# EAGLE design open-usb-can-2021 (EAGLE 9.6.2)
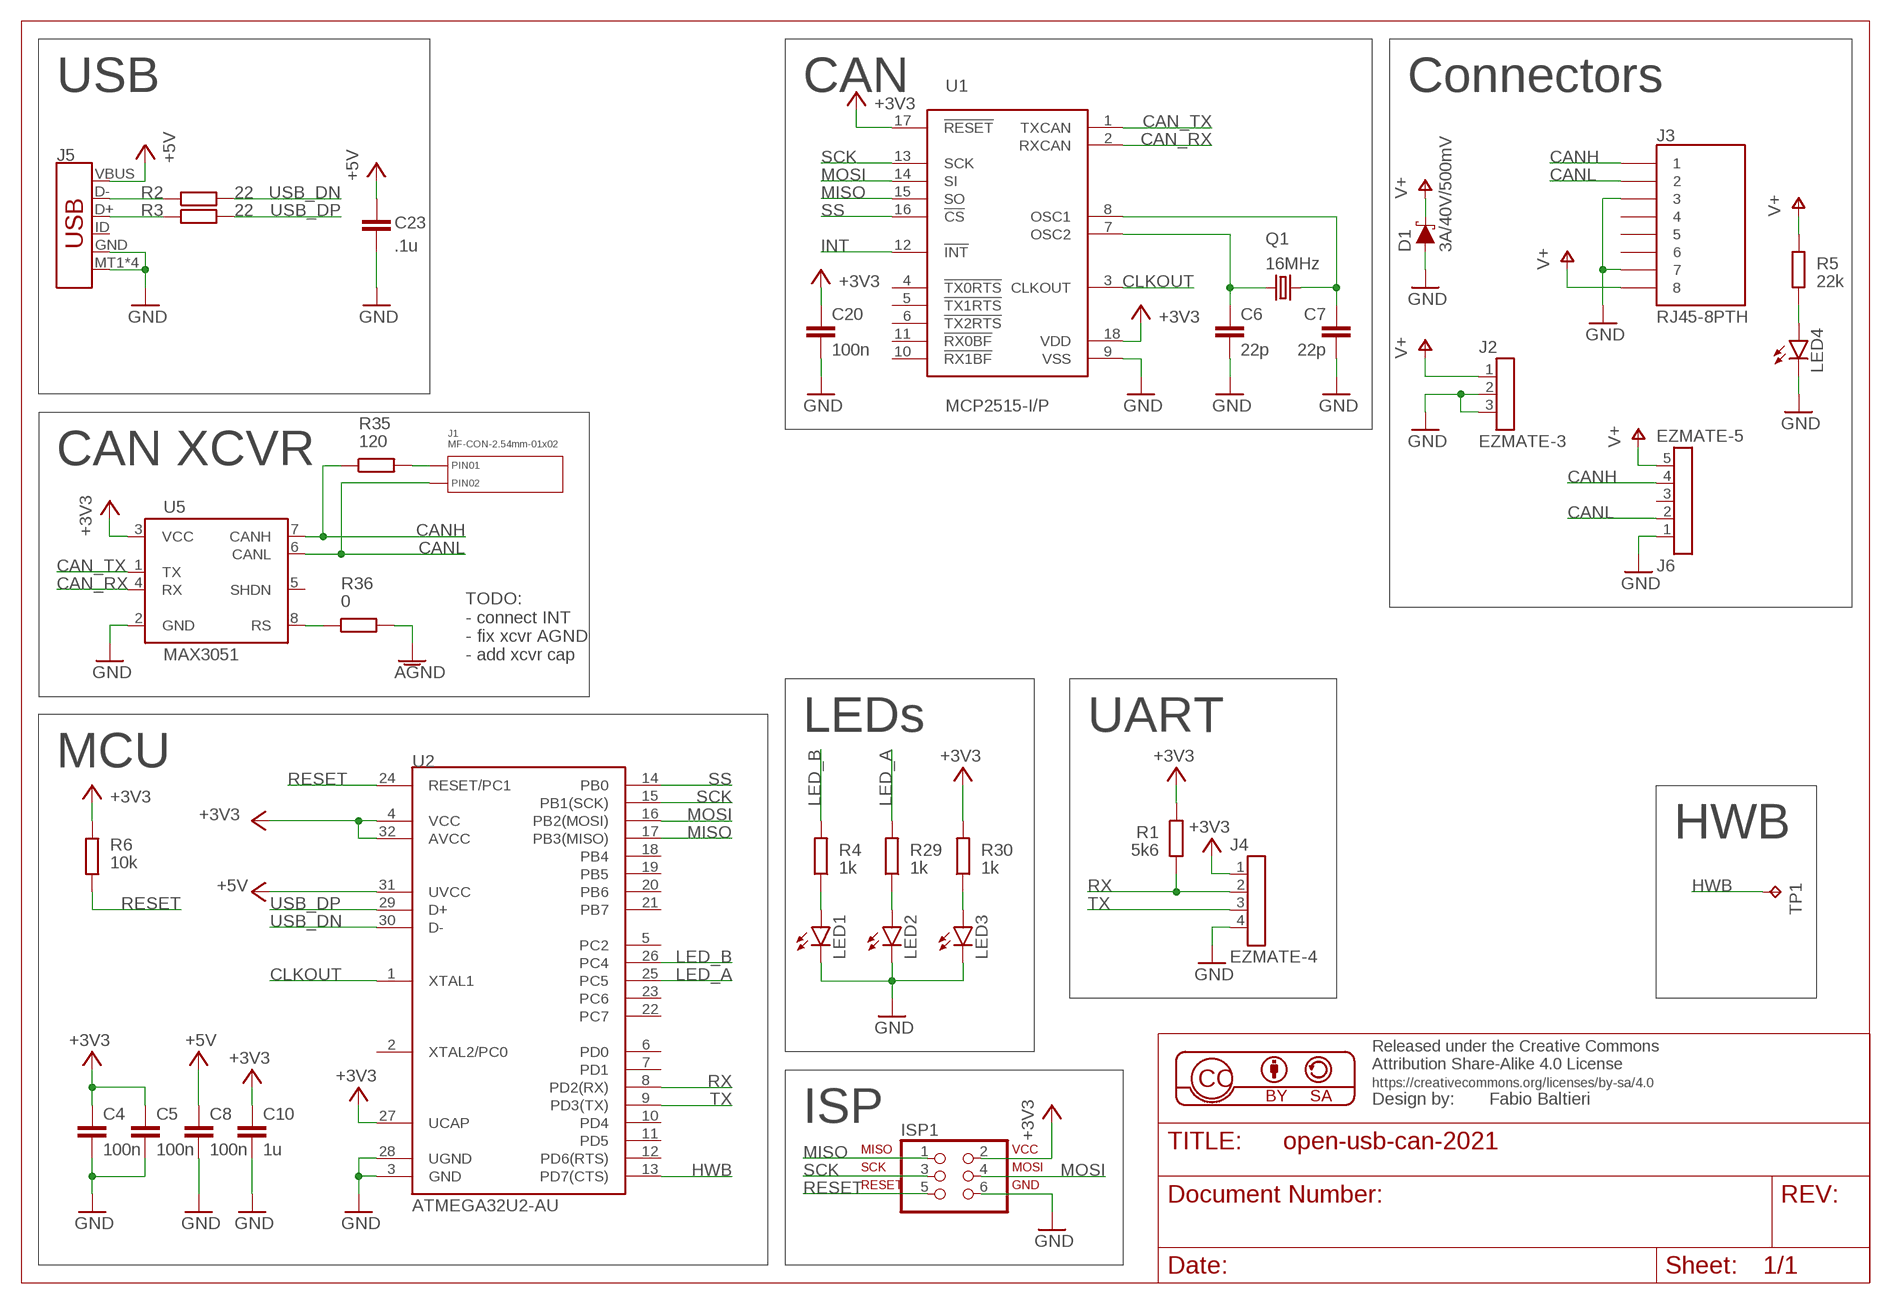
[diagram p0: schematic, sheet 1]

## Parts
C4  100n  C0402  [0402]
C5  100n  C0402  [0402]
C6  22p  C-EUC0805  [C0805]
C7  22p  C-EUC0805  [C0805]
C8  100n  C0402  [0402]
C10  1u  C0603  [0603]
C20  100n  C0402  [0402]
C23  .1u  C0603  [0603]
D1  3A/40V/500mV  DIODE-SCHOTTKY-B340A  [SMA-DIODE]
ISP1  ISP-AVR910TP  [2X03_TP]
J1  MF-CON-2.54mm-01x02  CON_01X02_PTH_2.54MM  [PTH_2.54MM_01X02]
J2  EZMATE-3  [EZMATE-3]
J3  RJ45-8PTH  [RJ45-8]
J4  EZMATE-4  [EZMATE-4]
J5  USB_MICRO-B_SMT  [USB-MICROB]
J6  EZMATE-5  [EZMATE-5]
LED1  LEDCHIPLED_0603  [CHIPLED_0603]
LED2  LEDCHIPLED_0603  [CHIPLED_0603]
LED3  LEDCHIPLED_0603  [CHIPLED_0603]
LED4  LEDCHIPLED_0603  [CHIPLED_0603]
Q1  16MHz  CRYSTALHC49UV  [HC49U-V]
R1  5k6  R0402  [0402]
R2  22  R0603  [0603]
R3  22  R0603  [0603]
R4  1k  R0402  [0402]
R5  22k  R0603  [0603]
R6  10k  R0402  [0402]
R29  1k  R0402  [0402]
R30  1k  R0402  [0402]
R35  120  R-EU_R0805  [R0805]
R36  0  R0603  [0603]
TP1  TPTP08R  [TP08R]
U1  MCP2515-I/P  [SO-18DW]
U2  ATMEGA32U2-AU  ATMEGA8U2AU  [TQFP32-08]
U5  MAX3051  [SO08]

## Nets
+3V3 [power12]: C4.1 C5.1 C10.1 C20.1 ISP1.2 J4.1 R1.1 R6.1 R30.2 U1.17(!RESET) U1.18(VDD) U2.4(VCC) U2.27(UCAP) U2.32(AVCC) U5.3(VCC)
+5V [power16]: C8.1 C23.1 J5.VBUS U2.31(UVCC)
AGND: R36.2
CAN_RX: U1.2(RXCAN) U5.4(RX)
CAN_TX: U1.1(TXCAN) U5.1(TX)
CANH: J3.1 J6.4 R35.1 U5.7(CANH)
CANL: J1.P$2(PIN2) J3.2 J6.2 U5.6(CANL)
CLKOUT: U1.3(CLKOUT) U2.1(XTAL1)
GND: C4.2 C5.2 C6.2 C7.2 C8.2 C10.2 C20.2 C23.2 D1.A ISP1.6 J2.2 J2.3 J3.3 J3.7 J4.4 J5.GND J5.MT1(SHIELD) J5.MT2(SHIELD) J5.P$1(SHIELD) J5.P$2(SHIELD) J6.1 LED1.C LED2.C LED3.C LED4.C U1.9(VSS) U2.3(GND) U2.28(UGND) U5.2(GND)
HWB: TP1.TP U2.13(PD7(CTS))
INT: U1.12(!INT)
LED_A: R29.2 U2.25(PC5)
LED_B: R4.2 U2.26(PC4)
MISO: ISP1.1 U1.15(SO) U2.17(PB3(MISO))
MOSI: ISP1.4 U1.14(SI) U2.16(PB2(MOSI))
N$2: J5.D- R2.1
N$3: J5.D+ R3.1
N$4: C7.1 Q1.2 U1.8(OSC1)
N$5: C6.1 Q1.1 U1.7(OSC2)
N$6: LED4.A R5.1
N$8: LED1.A R4.1
N$23: LED2.A R29.1
N$24: LED3.A R30.1
N$25: R36.1 U5.8(RS)
N$27: J1.P$1(PIN1) R35.2
RESET: ISP1.5 R6.2 U2.24(RESET/PC1)
RX: J4.2 R1.2 U2.8(PD2(RX))
SCK: ISP1.3 U1.13(SCK) U2.15(PB1(SCK))
SS: U1.16(!CS) U2.14(PB0)
TX: J4.3 U2.9(PD3(TX))
USB_DN: R2.2 U2.30(D-)
USB_DP: R3.2 U2.29(D+)
V+: D1.C J2.1 J3.8 J6.5 R5.2
Unconnected: J3.4 J3.5 J3.6 J5.ID J6.3 U1.4(!TX0RTS) U1.5(!TX1RTS) U1.6(!TX2RTS) U1.10(!RX1BF) U1.11(!RX0BF) U2.2(XTAL2/PC0) U2.5(PC2) U2.6(PD0) U2.7(PD1) U2.10(PD4) U2.11(PD5) U2.12(PD6(RTS)) U2.18(PB4) U2.19(PB5) U2.20(PB6) U2.21(PB7) U2.22(PC7) U2.23(PC6) U5.5(SHDN)

## Notes on the sheet
- USB | CAN | Connectors
- CAN XCVR
- TODO:
  - connect INT
  - fix xcvr AGND
  - add xcvr cap
- LEDs | UART
- MCU
- HWB
- ISP

## Library data of the parts
C4 C5 C8 C10 C20 C23 = balto:C: Capacitor
C6 C7 = rcl:C-EU: CAPACITOR, European symbol; SPICEPREFIX: C
D1 = SparkFun-DiscreteSemi:DIODE-SCHOTTKY: Schottky diode A Schottky diode is a semiconductor diode which has a low forward voltage drop and a very fast switching action.; PROD_ID: DIO-09886
ISP1 = balto:ISP-AVR910: PIN HEADER
J1 = MF_Connectors:CON_01X02: Library: MF_Connectors Description: Header Connector with 02 Positions and 01 Rows. Use the LABEL Attribute to label the pin on the schematic and PCB. You can remove the attributes on the PCB by using the SMASH function on the part and then deleting the text.; HOUSEPART: YES; MPN: MF-CON-2.54mm-01x02; POPULATE: 1; URL: https://factory.macrofab.com/part/MF-CON-2.54mm-01x02
J2 = balto:EZMATE-3: Molex Pico-EZMate
J3 = balto:RJ45-8: RJ45 Jack Simple RJ45, 8-pin connection - connector for common Cat5, Cat5e, and Cat6 Ethernet cables. Footprint not yet proven in production. Connector sku is PRT-00643; Breakout PCB sku is BOB-00716.
J4 = balto:EZMATE-4: Molex Pico-EZMate
J5 = SparkFun-Connectors:USB_MICRO-B: USB Type Micro-B Connector Male/female and PTH/SMT variants SparkFun Products: SparkFun microB USB Breakout <https://www.sparkfun.com/products/12035> SparkFun USB microB Plug Breakout <https://www.sparkfun.com/products/10031> SparkFun ESP8266 Thing <https://www.sparkfun.com/products/13231>; PROD_ID: CONN-09505; SF_ID: PRT-08533
J6 = balto:EZMATE-5: Molex Pico-EZMate
LED1-LED4 = led:LED: LED OSRAM: - CHIPLED LG R971, LG N971, LY N971, LG Q971, LY Q971, LO R971, LY R971 LH N974, LH R974 LS Q976, LO Q976, LY Q976 LO Q996 - Hyper CHIPLED LW Q18S LB Q993, LB Q99A, LB R99A - SideLED LS A670, LO A670, LY A670, LG A670, LP A670 LB A673, LV A673, LT A673, LW A673 LH A674 LY A675 LS A676, LA A676, LO A676, LY A676, LW A676 LS A679, LY A679, LG A679 - Hyper Micro SIDELED® LS Y876, LA Y876, LO Y876, LY Y876 LT Y87S - SmartLED LW L88C, LW L88S LB L89C, LB L89S, LG L890 LS L89K, LO L89K, LY L89K LS L896, LA L896, LO L896, LY L896 - TOPLED LS T670, LO T670, LY T670, LG T670, LP T670 LSG T670, LSP T670, LSY T670, LOP T670, LYG T670 LG T671, LOG T671, LSG T671 LB T673, LV T673, LT T673, LW T673 LH T674 LS T676, LA T676, LO T676, LY T676, LB T676, LH T676, LSB T676, LW T676 LB T67C, LV T67C, LT T67C, LS T67K, LO T67K, LY T67K, LW E67C LS E67B, LA E67B, LO E67B, LY E67B, LB E67C, LV E67C, LT E67C LW T67C LS T679, LY T679, LG T679 LS T770, LO T770, LY T770, LG T770, LP T770 LB T773, LV T773, LT T773, LW T773 LH T774 LS E675, LA E675, LY E675, LS T675 LS T776, LA T776, LO T776, LY T776, LB T776 LHGB T686 LT T68C, LB T68C - Hyper Mini TOPLED® LB M676 - Mini TOPLED Santana® LG M470 LS M47K, LO M47K, LY M47K Source: http://www.osram.convergy.de LUXEON: - LUMILED® LXK2-PW12-R00, LXK2-PW12-S00, LXK2-PW14-U00, LXK2-PW14-V00 LXK2-PM12-R00, LXK2-PM12-S00, LXK2-PM14-U00 LXK2-PE12-Q00, LXK2-PE12-R00, LXK2-PE12-S00, LXK2-PE14-T00, LXK2-PE14-U00 LXK2-PB12-K00, LXK2-PB12-L00, LXK2-PB12-M00, LXK2-PB14-N00, LXK2-PB14-P00, LXK2-PB14-Q00 LXK2-PR12-L00, LXK2-PR12-M00, LXK2-PR14-Q00, LXK2-PR14-R00 LXK2-PD12-Q00, LXK2-PD12-R00, LXK2-PD12-S00 LXK2-PH12-R00, LXK2-PH12-S00 LXK2-PL12-P00, LXK2-PL12-Q00, LXK2-PL12-R00 Source: www.luxeon.com KINGBRIGHT: KA-3528ASYC Source: www.kingbright.com
Q1 = sparkfun:CRYSTAL: Crystals Various standard crystals. Proven footprints. Spark Fun Electronics SKU : COM-00534
R1-R6 R29 R30 R36 = balto:R: Resistor
R35 = rcl:R-EU_: RESISTOR, European symbol; SPICEPREFIX: R
TP1 = testpad:TP: Test pad
U1 = balto:MCP2515: MCP2515 Stand-Alone CAN Controller With SPI Interface
U2 = sparkfun:ATMEGA8U2: Atmel 8-bit Microcontroller with 8/16/32K Bystes of ISP Flash and USB Controller. ATmega8U2, ATmega16U2, and ATmega32U2
U5 = balto:MAX3051

## Net classes
0 default: width 0.2 mm
1 power12: width 0.305 mm
2 power16: width 0.406 mm

## Board
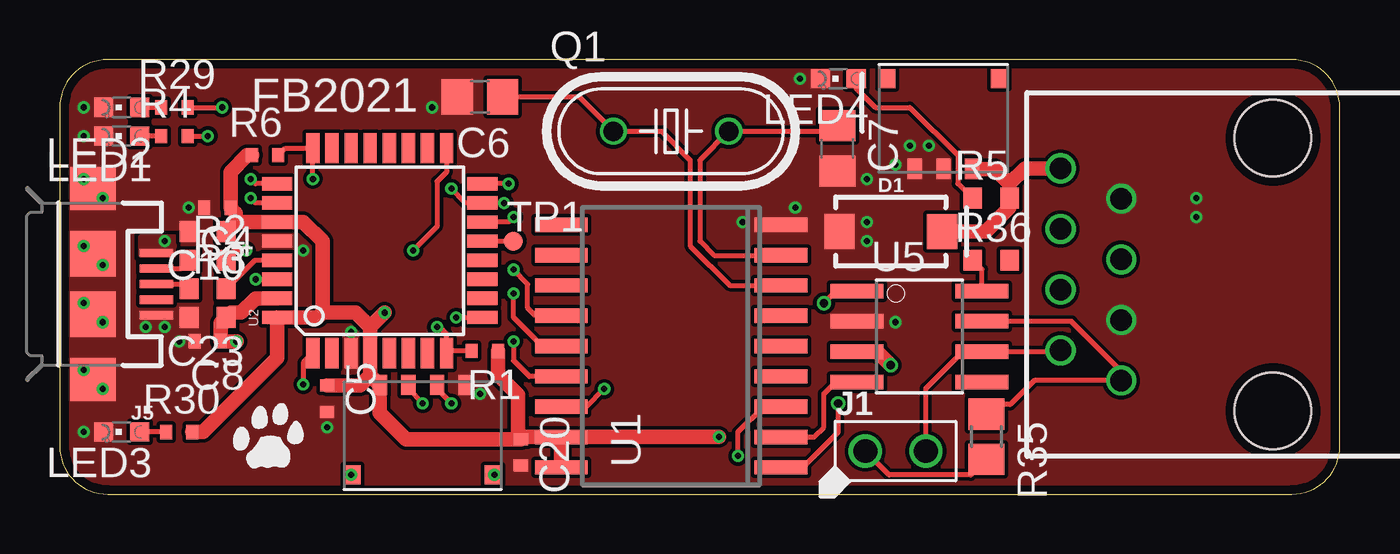
[diagram p1: board, top side]
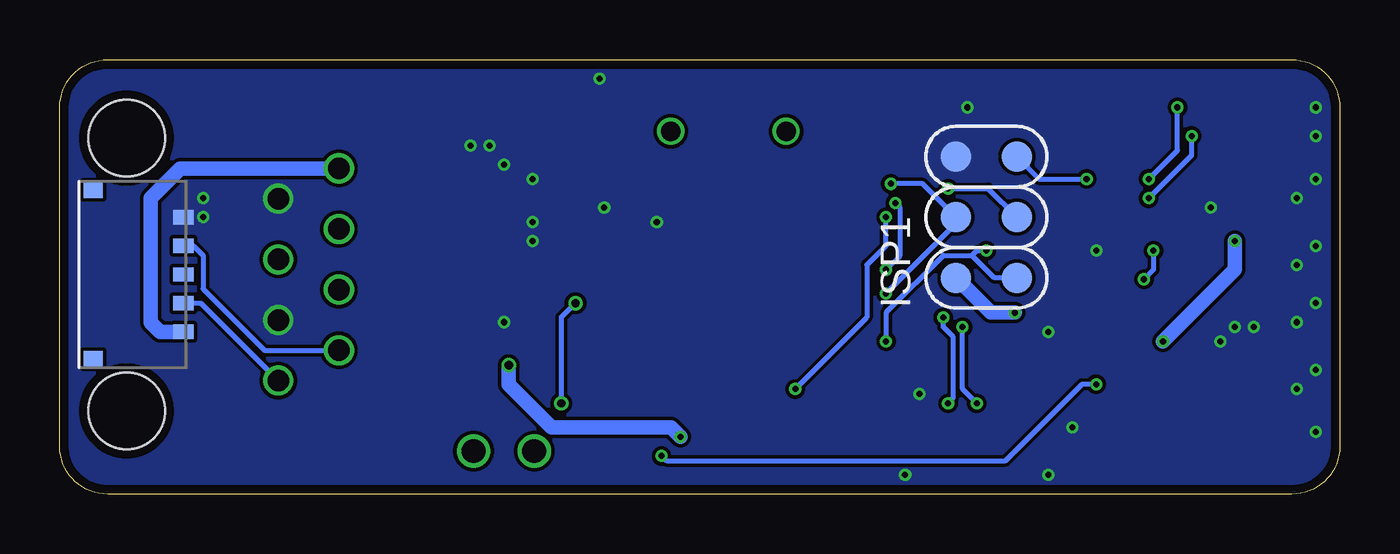
[diagram p2: board, bottom side, seen from below]

Size 53.6 x 18.2 mm. Coordinates in mm from the lower left corner, seen from the top.
Outline: 2,0 51.6,0 arc90 53.6,2 53.6,16.2 arc90 51.6,18.2 2,18.2 arc90 0,16.2 0,2 arc90 2,0
Copper layers (1+2*15+16): Top 0.0356mm / dielectric 0.1702mm / layer 2 0.0178mm / dielectric 47mil / layer 15 0.0178mm / dielectric 0.1702mm / Bottom 0.0356mm
Design rules "balto": minimum track width 6mil, minimum drill 10mil, track to track 6mil, track to pad 6mil, pad to pad 6mil, via to via 6mil, smd to smd 6mil, copper to edge 15mil, drill to drill 5mil, minimum pad ring 5mil, minimum via ring 5mil, stop-mask expansion 2mil, vias tented up to drill 20mil, thermal gap 8mil

### Footprints (pad centres in the part's own frame; a part is rotated, then mirrored left to right if it is on the bottom)
0402 = smd 0.5 x 0.6: 1 -0.55,0; 2 0.55,0
C0805 = smd 1.3 x 1.5: 1 -0.95,0; 2 0.95,0
0603 = smd 0.787 x 0.864: 1 -0.774,0; 2 0.774,0
SMA-DIODE = smd 1.27 x 1.47: A -2.15,0; C 2.15,0
2X03_TP = smd 1.27 x 1.27: 1 -2.54,-1.27; 2 -2.54,1.27; 3 0,-1.27; 4 0,1.27; 5 2.54,-1.27; 6 2.54,1.27
PTH_2.54MM_01X02 = drill 1: P$1 -1.27,0; P$2 1.27,0
EZMATE-3 = smd 0.6 x 0.85: 1 -1.2,3.775; 2 0,3.775; 3 1.2,3.775 | smd 0.7 x 0.8: M1 -2.35,0; M2 2.35,0
RJ45-8 = drill 0.9: 1 -4.445,6.35; 2 -3.175,8.89; 3 -1.905,6.35; 4 -0.635,8.89; 5 0.635,6.35; 6 1.905,8.89; 7 3.175,6.35; 8 4.445,8.89 | hole 3.2: -5.715,0; 5.715,0
EZMATE-4 = smd 0.6 x 0.85: 1 -1.8,3.775; 2 -0.6,3.775; 3 0.6,3.775; 4 1.8,3.775 | smd 0.7 x 0.8: M1 -2.95,0; M2 2.95,0
USB-MICROB = smd 1.4 x 0.35: D+ -2.65,0; D- -2.65,-0.65; GND -2.65,1.3; ID -2.65,0.65; VBUS -2.65,-1.3 | smd 1.9 x 1.8: MT1 0,-4; MT2 0,4 | smd 1.9 x 1.9: P$1 0,-1.27; P$2 0,1.27
EZMATE-5 = smd 0.6 x 0.85: 1 -2.4,3.775; 2 -1.2,3.775; 3 0,3.775; 4 1.2,3.775; 5 2.4,3.775 | smd 0.7 x 0.8: M1 -3.55,0; M2 3.55,0
CHIPLED_0603 = smd 0.8 x 0.8: A 0,-0.75; C 0,0.75
HC49U-V = drill 0.813: 1 -2.413,0; 2 2.413,0
R0805 = smd 1.3 x 1.5: 1 -0.95,0; 2 0.95,0
TP08R = smd 0.8 x 0.8: TP 0,0
SO-18DW = smd 0.6 x 2.2: 1 -5.08,-4.6; 2 -3.81,-4.6; 3 -2.54,-4.6; 4 -1.27,-4.6; 5 0,-4.6; 6 1.27,-4.6; 7 2.54,-4.6; 8 3.81,-4.6; 9 5.08,-4.6; 10 5.08,4.6; 11 3.81,4.6; 12 2.54,4.6; 13 1.27,4.6; 14 0,4.6; 15 -1.27,4.6; 16 -2.54,4.6; 17 -3.81,4.6; 18 -5.08,4.6
TQFP32-08 = smd 1.27 x 0.559: 1 -4.293,2.8; 2 -4.293,2; 3 -4.293,1.2; 4 -4.293,0.4; 5 -4.293,-0.4; 6 -4.293,-1.2; 7 -4.293,-2; 8 -4.293,-2.8; 17 4.293,-2.8; 18 4.293,-2; 19 4.293,-1.2; 20 4.293,-0.4; 21 4.293,0.4; 22 4.293,1.2; 23 4.293,2; 24 4.293,2.8 | smd 0.559 x 1.27: 9 -2.8,-4.293; 10 -2,-4.293; 11 -1.2,-4.293; 12 -0.4,-4.293; 13 0.4,-4.293; 14 1.2,-4.293; 15 2,-4.293; 16 2.8,-4.293; 25 2.8,4.293; 26 2,4.293; 27 1.2,4.293; 28 0.4,4.293; 29 -0.4,4.293; 30 -1.2,4.293; 31 -2,4.293; 32 -2.8,4.293
SO08 = smd 0.61 x 2.21: 1 -1.905,-2.616; 2 -0.635,-2.616; 3 0.635,-2.616; 4 1.905,-2.616; 5 1.905,2.616; 6 0.635,2.616; 7 -0.635,2.616; 8 -1.905,2.616

### Placement (x,y rotation side)
C4  6.6,12 180 top
C5  11.2,4 270 top
C6  17.6,16.64 180 top
C7  32.56,14.48 270 top
C8  6.2,6.4 180 top
C10  6.2,11 180 top
C20  19.31,1.75 270 top
C23  6.2,7.4 180 top
D1  34.8,11 0 top
ISP1  14.8,11.6 90 bottom
J1  35,1.8 0 top
J2  37,17.4 180 top
J3  50.8,9.2 90 top
J4  15.2,0.8 0 top
J5  1.4,8.8 180 top
J6  52.2,9.2 270 bottom
LED1  2.6,15 90 top
LED2  2.6,16.2 90 top
LED3  2.6,2.6 90 top
LED4  32.6,17.4 90 top
Q1  25.6,15.2 0 top
R1  17.8,6 180 top
R2  6.2,9.8 0 top
R3  6.2,8.6 0 top
R4  4.8,15 0 top
R5  39,12.4 0 top
R6  8.6,14.2 0 top
R29  4.8,16.2 0 top
R30  5,2.6 0 top
R35  38.8,2.4 270 top
R36  39,9.8 0 top
TP1  19,10.6 0 top
U1  25.6,6.2 90 top
U2  13.4,10.2 90 top
U5  36,6.6 270 top
U$1  [CAT-L]  8.8,2 0 top

### Tracks (layer width: path | path; a pad name or v marks a point on that pad's centre or on a via)
+3V3  (via drill 0.25, 0.35)
  Top 0.6: 11,7.6 12.4,7.6 13,7 | 13,7 U2.4 13,4.97 | 13,4.97 J4.1 13.4,3.4 14.5,2.3 C20.1 | C5.1 12.57,4.55 13,4.97 | C20.1 19.4,2.39 U1.17 | U1.18 U1.17 | R1.1 18.35,5 19.2,4.15 19.2,2.41 C20.1 | U1.17 v27.59,2.39 v27.6,2.4 | 11,7.6 11,10.6 10.2,11.4 U2.27 7.38,11.4 | 7.38,11.4 C10.1 | 7.38,11.4 7.38,11.78 C4.1 7.15,13.5 7.85,14.2 R6.1 | R30.2 6,2.6 9.11,5.71 U2.32 10.8,7.4 11,7.6 | 13,7 v13.6,7.6 | v34.8,5.4 34.23,5.96 U5.3
  Bottom 0.6: v27.6,2.4 28,2.8 33,2.8 34.8,4.6 v34.8,5.4 | v13.6,7.6 14.6,7.6 ISP1.2
+5V  (via drill 0.25)
  Top 0.6: v7.4,6.4 C8.1 6.75,7.18 C23.1 7.17,7.6 7.6,7.6 8.2,8.2 U2.31
  Bottom 0.6: v4.4,10.6 4.4,9.4 v7.4,6.4
  pour Top (no thermals): 4.8,10 3.4,10 3.4,10.8 4.8,10.8
CAN_RX
  Top 0.2: U1.2 31.59,2.39 32,2.8 32,4.2 32.49,4.7 U5.4
CAN_TX  (via drill 0.35)
  Top 0.2: U1.1 31.12,1.12 32.6,2.6 v32.6,3.8 | U5.1 32.51,8.51 v32,8
  Bottom 0.2: v32,8 32.6,7.4 v32.6,3.8
CANH
  Top 0.2: 44.45,5.15 44.45,5.16 | 37.84,7.24 U5.7 42.37,7.24 44.45,5.15 | 44.45,5.15 J3.1 40.8,4.75 39.8,3.75 39.2,3.75 R35.1
  Bottom 0.2: J6.4 47.7,8 J3.1
CANL
  Top 0.2: J3.2 41.85,5.96 U5.6 37.8,5.96 36.27,4.43 J1.P$2
  Bottom 0.2: J6.2 48,10.4 47.6,10 47.6,8.6 45.02,6.03 J3.2
CLKOUT  (via drill 0.25)
  Top 0.2: U2.1 10.2,5.51 v10.2,4.6 | v28.4,1.6 28.4,2.6 29.46,3.66 U1.3
  Bottom 0.2: v10.2,4.6 10.8,4.6 14,1.4 28.2,1.4 v28.4,1.6
GND  (via drill 0.25)
  other vias: 5.4,12 10.2,10.2 3.6,7 4.4,7 1,2.6 1,16.2 1,15 1,13.2 1.8,12.4 1,10.4 1.8,9.6 1,8 1.8,7.2 1,5.2 1.8,4.4 5,6.4 11.2,2.8 12.2,0.8 18.2,0.8 17.6,4.2 12.2,6.8 28.6,11.4 30.8,12 15.6,16.2 35.6,14.6 31,17.4 35,7.2 33.8,11.4 33.8,10.6 36.4,14.6 35,13.8 33.8,13.2 47.6,11.6 47.6,12.4
  pour Top (rank 3, no thermals): -1,-1 54.6,-1 54.6,19.2 -1,19.2
  pour Bottom (rank 3, no thermals): -2,-2 55.6,-2 55.6,20.2 -2,20.2
HWB
  Top 0.2: U2.13 TP1.TP
LED_A  (via drill 0.25)
  Top 0.2: U2.25 8.2,13 v8,13.2 | R29.2 v6.8,16.2
  Bottom 0.2: v8,13.2 6.8,14.4 v6.8,16.2
LED_B  (via drill 0.25)
  Top 0.2: U2.26 8.2,12.2 v8,12.4 | R4.2 v6.2,15
  Bottom 0.2: v8,12.4 6.2,14.2 v6.2,15
MISO  (via drill 0.25)
  Top 0.2: U2.17 16.2,13.49 15.8,13.09 15.8,11.2 v14.8,10.2 | U1.15 19.67,4.93 19,5.6 v19,6.4
  Bottom 0.2: ISP1.1 14.46,9.06 15.4,10 | 15.4,10 16.6,10 19,7.6 v19,6.4 | 15.4,10 15.2,10.2 v14.8,10.2
MOSI  (via drill 0.25)
  Top 0.2: U1.14 20.2,6.2 19,7.4 v19,8.4 | v18.8,13 U2.16
  Bottom 0.2: v19,8.4 16.07,11.33 ISP1.4 17.47,13 v18.8,13
N$2
  Top 0.2: J5.D- 5.08,9.45 R2.1
N$3
  Top 0.2: J5.D+ 5.23,8.8 R3.1
N$4
  Top 0.2: U1.8 27.4,10 26.8,10.6 26.8,13.99 Q1.2 32.33,15.2 C7.1
N$5
  Top 0.2: C6.1 21.75,16.64 Q1.1 25.2,15.2 26.4,14 26.4,10.4 28.06,8.74 U1.7
N$6
  Top 0.2: LED4.A 33.35,17 34.15,16.2 35.6,16.2 37.6,14.2 37.6,13 38.2,12.4 R5.1
N$8
  Top 0.2: R4.1 LED1.A
N$23
  Top 0.2: R29.1 LED2.A
N$24
  Top 0.2: R30.1 LED3.A
N$25
  Top 0.2: U5.8 38.62,9.41 R36.1
N$27
  Top 0.2: R35.2 38.15,0.8 34.73,0.8 J1.P$1
RESET  (via drill 0.25)
  Top 0.2: R6.2 9.44,14.49 U2.24 v10.6,13.2
  Bottom 0.2: ISP1.5 12.6,13.2 v10.6,13.2
RX  (via drill 0.25)
  Top 0.2: R1.2 16.29,6 U2.8 16.2,6.71 15.91,7 v15.8,7 | J4.2 14.6,4.4 v15.2,3.8
  Bottom 0.2: v15.2,3.8 15.8,4.4 v15.8,7
SCK  (via drill 0.25)
  Top 0.2: U1.13 19.93,7.47 19.6,7.8 19.6,8.8 v19,9.4 | v18.6,12.2 U2.15 17,12.2 v16.4,12.8
  Bottom 0.2: v19,9.4 18.4,10 18.4,12 v18.6,12.2 | v16.4,12.8 14.73,12.8 ISP1.3
SS  (via drill 0.25)
  Top 0.2: U1.16 22.06,3.66 v22.8,4.4 | v19,11.6 18.8,11.4 U2.14
  Bottom 0.2: v22.8,4.4 19.8,7.4 19.8,9.6 19,10.4 v19,11.6
TX  (via drill 0.25)
  Top 0.2: J4.3 15.8,4.4 v16.4,3.8 | v16.6,7.4 U2.9
  Bottom 0.2: v16.4,3.8 16.2,4 16.2,6.6 16.6,7 v16.6,7.4
USB_DN  (via drill 0.25)
  Top 0.2: v7.8,10.2 7.38,10.2 R2.2 | v8.2,9 U2.30
  Bottom 0.2: v7.8,10.2 7.8,9.4 v8.2,9
USB_DP
  Top 0.2: R3.2 7.49,9.11 8.18,9.8 U2.29
V+
  Top 0.6: J2.1 38.23,13.6 | 36.95,11.32 D1.C 38.77,11 39.77,12 R5.2 39.77,13 | 38.22,13.64 J2.1 | J2.1 39.15,13.62 39.77,13 | J3.8 40.42,13.64 39.77,13
  Bottom 0.6: J3.8 48.55,13.64 49.8,12.4 49.8,7.2 49.4,6.8 J6.5

### Text on the board
_tsilk: FB2021